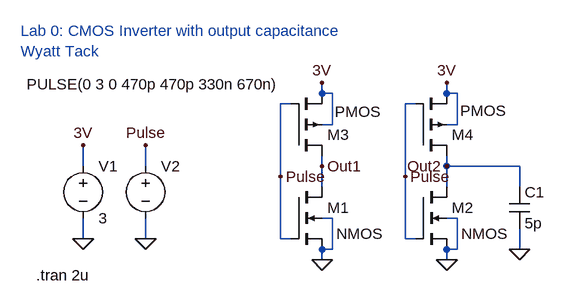
[diagram p0: schematic Lab0 Inverter.asc]
Lab0 Inverter.asc, the LTspice schematic file:
Version 4
SHEET 1 880 680
WIRE 272 16 272 0
WIRE 288 16 272 16
WIRE 464 16 464 0
WIRE 480 16 464 16
WIRE 224 32 208 32
WIRE 416 32 400 32
WIRE 288 64 288 16
WIRE 288 64 272 64
WIRE 480 64 480 16
WIRE 480 64 464 64
WIRE -96 128 -96 96
WIRE 0 128 0 96
WIRE 272 128 272 112
WIRE 464 128 464 112
WIRE 576 128 464 128
WIRE 208 144 208 32
WIRE 400 144 400 32
WIRE 272 160 272 128
WIRE 464 160 464 128
WIRE 576 160 576 128
WIRE 288 208 272 208
WIRE 480 208 464 208
WIRE -96 240 -96 208
WIRE 0 240 0 208
WIRE 208 240 208 144
WIRE 224 240 208 240
WIRE 400 240 400 144
WIRE 416 240 400 240
WIRE 288 256 288 208
WIRE 288 256 272 256
WIRE 480 256 480 208
WIRE 480 256 464 256
WIRE 576 256 576 224
WIRE 272 272 272 256
WIRE 464 272 464 256
FLAG 272 272 0
FLAG 0 240 0
FLAG -96 240 0
FLAG -96 96 3V
FLAG 272 0 3V
FLAG 0 96 Pulse
FLAG 208 144 Pulse
FLAG 464 272 0
FLAG 464 0 3V
FLAG 400 144 Pulse
FLAG 576 256 0
FLAG 272 128 Out1
FLAG 464 128 Out2
SYMBOL voltage -96 112 R0
WINDOW 123 0 0 Left 0
WINDOW 39 0 0 Left 0
SYMATTR InstName V1
SYMATTR Value 3
SYMBOL voltage 0 112 R0
WINDOW 3 209 -110 Right 2
WINDOW 123 0 0 Left 0
WINDOW 39 0 0 Left 0
SYMATTR Value PULSE(0 3 0 470p 470p 330n 670n)
SYMATTR InstName V2
SYMBOL cap 560 160 R0
SYMATTR InstName C1
SYMATTR Value 5p
SYMBOL pmos4 416 112 M180
WINDOW 3 69 69 Left 2
SYMATTR InstName M4
SYMATTR Value2 l=500n w=2u
SYMBOL pmos4 224 112 M180
WINDOW 3 68 68 Left 2
SYMATTR InstName M3
SYMATTR Value2 l=500n w=2u
SYMBOL nmos4 416 160 R0
WINDOW 3 70 72 Left 2
SYMATTR InstName M2
SYMBOL nmos4 224 160 R0
WINDOW 3 70 72 Left 2
SYMATTR InstName M1
TEXT -168 296 Left 2 !.tran 2u
TEXT -192 -80 Left 2 ;Lab 0: CMOS Inverter with output capacitance\nWyatt Tack

The netlist it stands for:
* Lab0 Inverter.asc
V1 3V 0 3
V2 Pulse 0 PULSE(0 3 0 470p 470p 330n 670n)
C1 Out2 0 5p
M4 Out2 Pulse 3V 3V PMOS l=500n w=2u
M3 Out1 Pulse 3V 3V PMOS l=500n w=2u
M2 Out2 Pulse 0 0 NMOS
M1 Out1 Pulse 0 0 NMOS
.model NMOS NMOS
.model PMOS PMOS
.lib standard.mos
.tran 2u
* Lab 0: CMOS Inverter with output capacitance
* Wyatt Tack
.backanno
.end